# EAGLE design lamloei_app_a092500 (EAGLE 7.7.0)
CNAME: LamLoei A092500; CREVISION: R1; DESIGNER: lamloei co.,ltd.
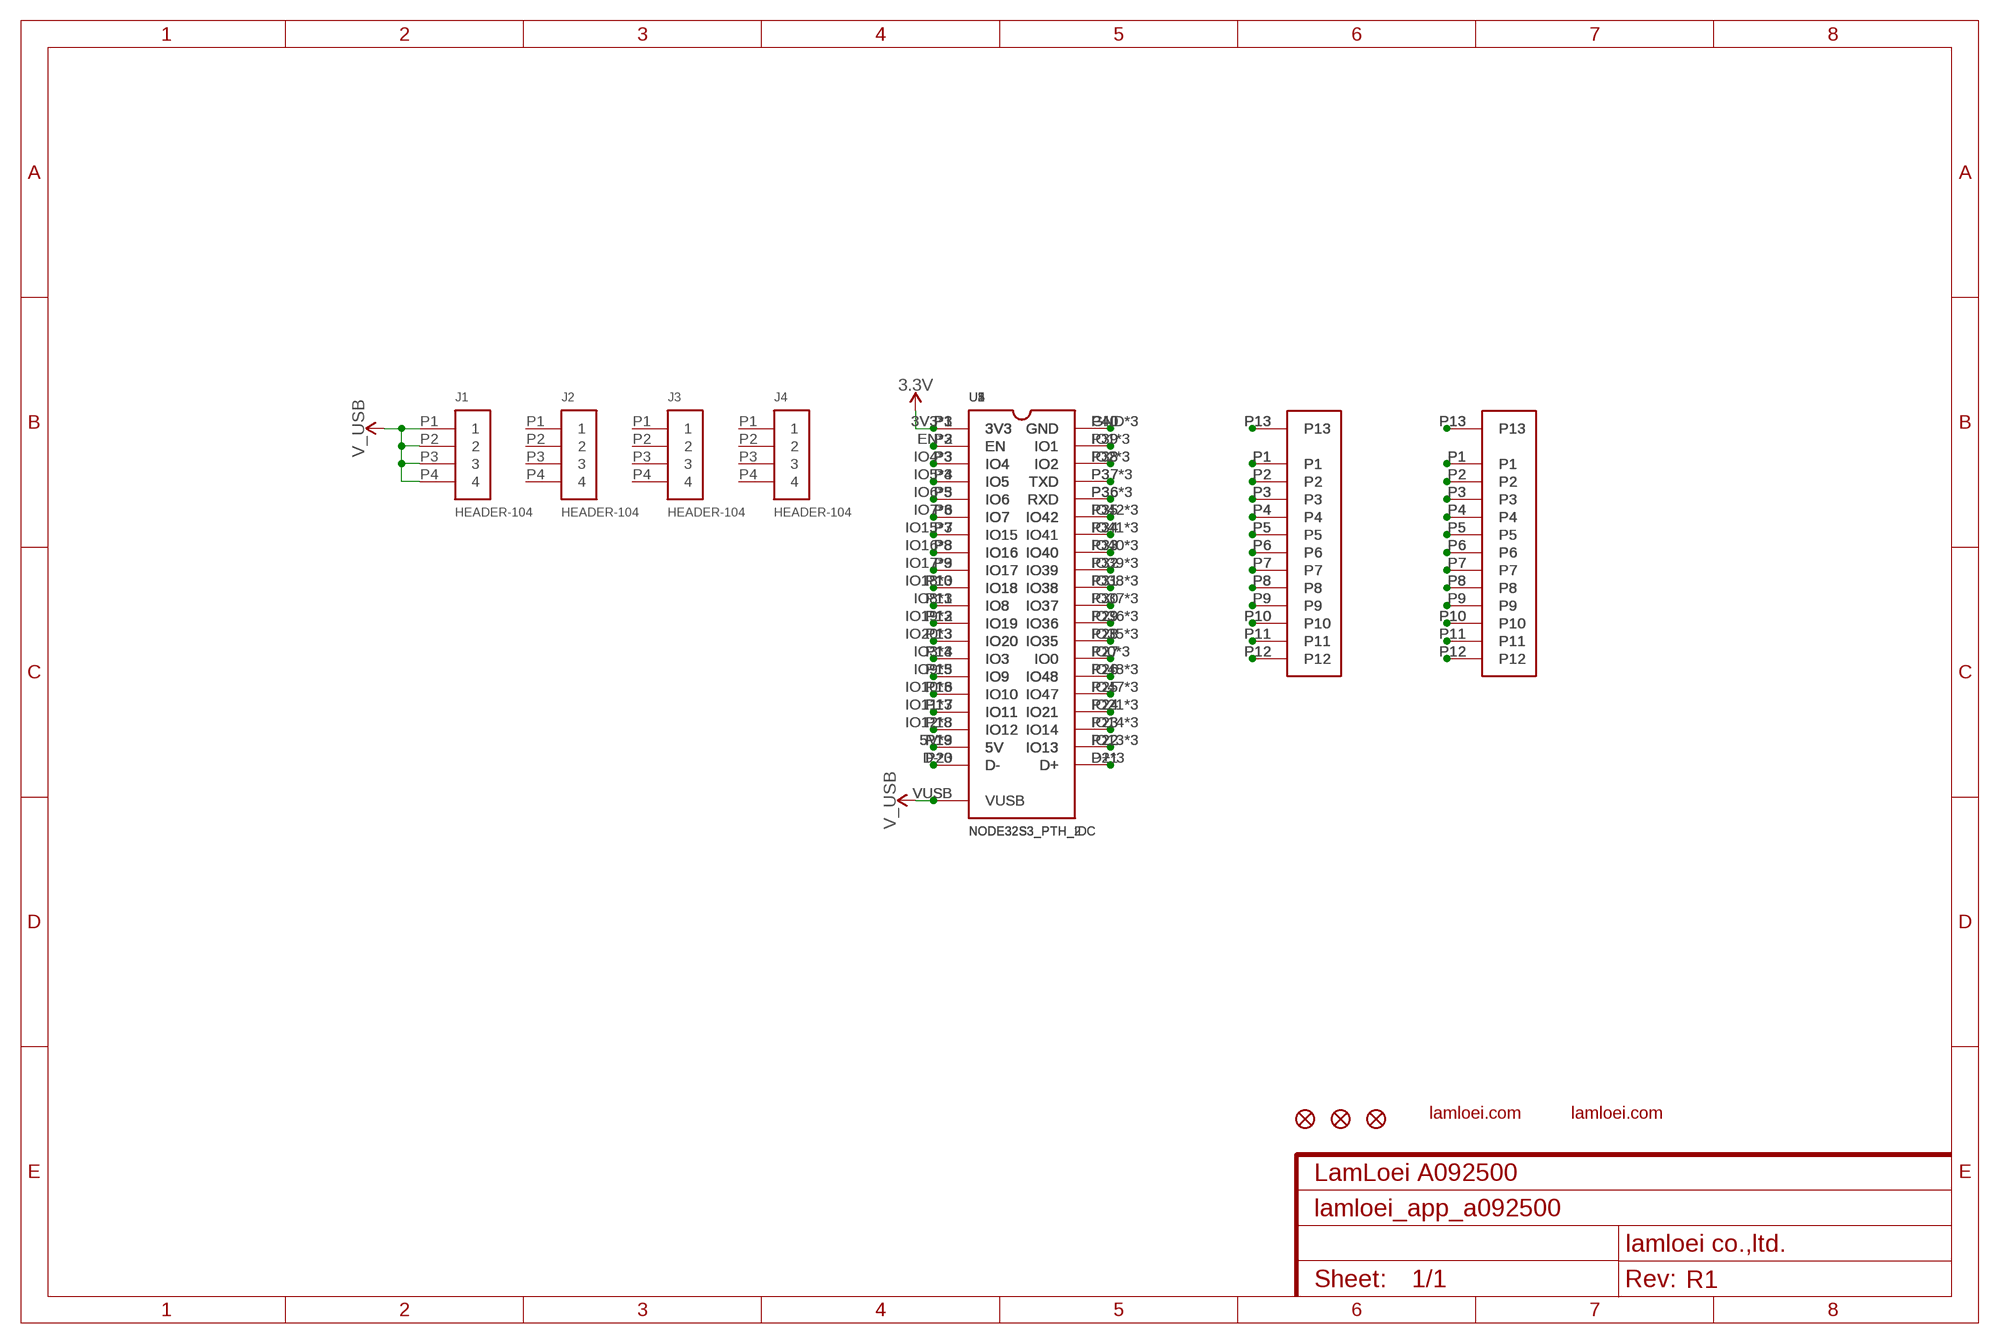
[diagram p0: schematic, sheet 1]

## Parts
J1  HEADER-104  [HEADER-104]
J2  HEADER-104  [HEADER-104]
J3  HEADER-104  [HEADER-104]
J4  HEADER-104  [HEADER-104]
U1  NODE32S3_PTH_2  [NODE32S3_PTH_2]
U2  NODE32S3_PTH_2  [NODE32S3_PTH_2]
U3  NODE32S3_PTH_IDC  [NODE32S3_PTH_IDC]
U4  NODE32S3_PTH_IDC  [NODE32S3_PTH_IDC]
U5  NODE32S3_PTH_IDC  [NODE32S3_PTH_IDC]
X1  5EHDRC-12P  [5EHDRC-12P]
X2  5EHDRC-12P-5.08MM  [5EHDRC-12P-5.08MM]
X3  5EHDRC-12P-2  [5EHDRC-12P-2]
X4  5EHDRC-12P  [5EHDRC-12P]
X5  5EHDRC-12P-5.08MM  [5EHDRC-12P-5.08MM]
X6  5EHDRC-12P-2  [5EHDRC-12P-2]
ZFD1  FIDUCIAL1X2  [FIDUCIAL-1X2]
ZFD2  FIDUCIAL1X2  [FIDUCIAL-1X2]
ZFD3  FIDUCIAL1X2  [FIDUCIAL-1X2]
ZL1  LAMLEOI_LOGO_3  [LAMLEOI_LOGO_3]
ZL2  LAMLEOI_LOGO_3  [LAMLEOI_LOGO_3]

## Nets
3.3V: U1.3V3 U1.P1(3V3) U1.Q1(3V3) U2.3V3 U2.P1(3V3) U2.Q1(3V3) U3.P1(3V3) U4.P1(3V3) U5.P1(3V3)
N$3: U1.EN U1.P2(EN) U1.Q2(EN) U2.EN U2.P2(EN) U2.Q2(EN) U3.P2(EN) U4.P2(EN) U5.P2(EN)
N$4: U1.IO4 U1.P3(IO4) U1.Q3(IO4) U2.IO4 U2.P3(IO4) U2.Q3(IO4) U3.P3(IO4) U4.P3(IO4) U5.P3(IO4)
N$5: U1.IO5 U1.P4(IO5) U1.Q4(IO5) U2.IO5 U2.P4(IO5) U2.Q4(IO5) U3.P4(IO5) U4.P4(IO5) U5.P4(IO5)
N$6: U1.IO6 U1.P5(IO6) U1.Q5(IO6) U2.IO6 U2.P5(IO6) U2.Q5(IO6) U3.P5(IO6) U4.P5(IO6) U5.P5(IO6)
N$7: U1.IO7 U1.P6(IO7) U1.Q6(IO7) U2.IO7 U2.P6(IO7) U2.Q6(IO7) U3.P6(IO7) U4.P6(IO7) U5.P6(IO7)
N$8: U1.IO15 U1.P7(IO15) U1.Q7(IO15) U2.IO15 U2.P7(IO15) U2.Q7(IO15) U3.P7(IO15) U4.P7(IO15) U5.P7(IO15)
N$9: U1.IO16 U1.P8(IO16) U1.Q8(IO16) U2.IO16 U2.P8(IO16) U2.Q8(IO16) U3.P8(IO16) U4.P8(IO16) U5.P8(IO16)
N$10: U1.IO17 U1.P9(IO17) U1.Q9(IO17) U2.IO17 U2.P9(IO17) U2.Q9(IO17) U3.P9(IO17) U4.P9(IO17) U5.P9(IO17)
N$11: U1.IO18 U1.P10(IO18) U1.Q10(IO18) U2.IO18 U2.P10(IO18) U2.Q10(IO18) U3.P10(IO18) U4.P10(IO18) U5.P10(IO18)
N$12: U1.IO8 U1.P11(IO8) U1.Q11(IO8) U2.IO8 U2.P11(IO8) U2.Q11(IO8) U3.P11(IO8) U4.P11(IO8) U5.P11(IO8)
N$13: U1.IO19 U1.P12(IO19) U1.Q12(IO19) U2.IO19 U2.P12(IO19) U2.Q12(IO19) U3.P12(IO19) U4.P12(IO19) U5.P12(IO19)
N$14: U1.IO20 U1.P13(IO20) U1.Q13(IO20) U2.IO20 U2.P13(IO20) U2.Q13(IO20) U3.P13(IO20) U4.P13(IO20) U5.P13(IO20)
N$15: U1.IO3 U1.P14(IO3) U1.Q14(IO3) U2.IO3 U2.P14(IO3) U2.Q14(IO3) U3.P14(IO3) U4.P14(IO3) U5.P14(IO3)
N$16: U1.IO9 U1.P15(IO9) U1.Q15(IO9) U2.IO9 U2.P15(IO9) U2.Q15(IO9) U3.P15(IO9) U4.P15(IO9) U5.P15(IO9)
N$17: U1.IO11 U1.P17(IO11) U1.Q17(IO11) U2.IO11 U2.P17(IO11) U2.Q17(IO11) U3.P17(IO11) U4.P17(IO11) U5.P17(IO11)
N$18: U1.IO10 U1.P16(IO10) U1.Q16(IO10) U2.IO10 U2.P16(IO10) U2.Q16(IO10) U3.P16(IO10) U4.P16(IO10) U5.P16(IO10)
N$19: U1.IO12 U1.P18(IO12) U1.Q18(IO12) U2.IO12 U2.P18(IO12) U2.Q18(IO12) U3.P18(IO12) U4.P18(IO12) U5.P18(IO12)
N$20: U1.5V U1.P19(5V) U1.Q19(5V) U2.5V U2.P19(5V) U2.Q19(5V) U3.P19(5V) U4.P19(5V) U5.P19(5V)
N$21: U1.D- U1.P20(D-) U1.Q20(D-) U2.D- U2.P20(D-) U2.Q20(D-) U3.P20(D-) U4.P20(D-) U5.P20(D-)
N$22: U1.D+ U1.P21(D+) U1.Q21(D+) U2.D+ U2.P21(D+) U2.Q21(D+) U3.P21(D+) U4.P21(D+) U5.P21(D+)
N$23: U1.IO13 U1.P22(IO13) U1.Q22(IO13) U2.IO13 U2.P22(IO13) U2.Q22(IO13) U3.P22(IO13) U4.P22(IO13) U5.P22(IO13)
N$24: U1.IO14 U1.P23(IO14) U1.Q23(IO14) U2.IO14 U2.P23(IO14) U2.Q23(IO14) U3.P23(IO14) U4.P23(IO14) U5.P23(IO14)
N$25: U1.IO21 U1.P24(IO21) U1.Q24(IO21) U2.IO21 U2.P24(IO21) U2.Q24(IO21) U3.P24(IO21) U4.P24(IO21) U5.P24(IO21)
N$26: U1.IO47 U1.P25(IO47) U1.Q25(IO47) U2.IO47 U2.P25(IO47) U2.Q25(IO47) U3.P25(IO47) U4.P25(IO47) U5.P25(IO47)
N$27: U1.IO48 U1.P26(IO48) U1.Q26(IO48) U2.IO48 U2.P26(IO48) U2.Q26(IO48) U3.P26(IO48) U4.P26(IO48) U5.P26(IO48)
N$28: U1.IO0 U1.P27(IO0) U1.Q27(IO0) U2.IO0 U2.P27(IO0) U2.Q27(IO0) U3.P27(IO0) U4.P27(IO0) U5.P27(IO0)
N$29: U1.IO35 U1.P28(IO35) U1.Q28(IO35) U2.IO35 U2.P28(IO35) U2.Q28(IO35) U3.P28(IO35) U4.P28(IO35) U5.P28(IO35)
N$30: U1.IO36 U1.P29(IO36) U1.Q29(IO36) U2.IO36 U2.P29(IO36) U2.Q29(IO36) U3.P29(IO36) U4.P29(IO36) U5.P29(IO36)
N$31: U1.IO37 U1.P30(IO37) U1.Q30(IO37) U2.IO37 U2.P30(IO37) U2.Q30(IO37) U3.P30(IO37) U4.P30(IO37) U5.P30(IO37)
N$32: U1.IO38 U1.P31(IO38) U1.Q31(IO38) U2.IO38 U2.P31(IO38) U2.Q31(IO38) U3.P31(IO38) U4.P31(IO38) U5.P31(IO38)
N$33: U1.IO39 U1.P32(IO39) U1.Q32(IO39) U2.IO39 U2.P32(IO39) U2.Q32(IO39) U3.P32(IO39) U4.P32(IO39) U5.P32(IO39)
N$34: U1.IO40 U1.P33(IO40) U1.Q33(IO40) U2.IO40 U2.P33(IO40) U2.Q33(IO40) U3.P33(IO40) U4.P33(IO40) U5.P33(IO40)
N$35: U1.IO41 U1.P34(IO41) U1.Q34(IO41) U2.IO41 U2.P34(IO41) U2.Q34(IO41) U3.P34(IO41) U4.P34(IO41) U5.P34(IO41)
N$36: U1.IO42 U1.P35(IO42) U1.Q35(IO42) U2.IO42 U2.P35(IO42) U2.Q35(IO42) U3.P35(IO42) U4.P35(IO42) U5.P35(IO42)
N$37: U1.P36(RXD) U1.Q36(RXD) U1.RXD U2.P36(RXD) U2.Q36(RXD) U2.RXD U3.P36(RXD) U4.P36(RXD) U5.P36(RXD)
N$38: U1.P37(TXD) U1.Q37(TXD) U1.TXD U2.P37(TXD) U2.Q37(TXD) U2.TXD U3.P37(TXD) U4.P37(TXD) U5.P37(TXD)
N$39: U1.IO2 U1.P38(IO2) U1.Q38(IO2) U2.IO2 U2.P38(IO2) U2.Q38(IO2) U3.P38(IO2) U4.P38(IO2) U5.P38(IO2)
N$40: U1.IO1 U1.P39(IO1) U1.Q39(IO1) U2.IO1 U2.P39(IO1) U2.Q39(IO1) U3.P39(IO1) U4.P39(IO1) U5.P39(IO1)
N$41: U1.GND U1.P40(GND) U1.Q40(GND) U2.GND U2.P40(GND) U2.Q40(GND) U3.P40(GND) U4.P40(GND) U5.P40(GND)
N$42: X1.P1 X2.P1 X3.P1
N$43: X1.P2 X2.P2 X3.P2
N$44: X1.P3 X2.P3 X3.P3
N$45: X1.P4 X2.P4 X3.P4
N$46: X1.P5 X2.P5 X3.P5
N$47: X1.P6 X2.P6 X3.P6
N$48: X1.P7 X2.P7 X3.P7
N$49: X1.P8 X2.P8 X3.P8
N$50: X1.P9 X2.P9 X3.P9
N$51: X1.P10 X2.P10 X3.P10
N$52: X1.P11 X2.P11 X3.P11
N$53: X1.P12 X2.P12 X3.P12
N$54: X1.P13 X2.P13 X3.P13
N$55: X4.P1 X5.P1 X6.P1
N$56: X4.P2 X5.P2 X6.P2
N$57: X4.P3 X5.P3 X6.P3
N$58: X4.P4 X5.P4 X6.P4
N$59: X4.P5 X5.P5 X6.P5
N$60: X4.P6 X5.P6 X6.P6
N$61: X4.P7 X5.P7 X6.P7
N$62: X4.P8 X5.P8 X6.P8
N$63: X4.P9 X5.P9 X6.P9
N$64: X4.P10 X5.P10 X6.P10
N$65: X4.P11 X5.P11 X6.P11
N$66: X4.P12 X5.P12 X6.P12
N$67: X4.P13 X5.P13 X6.P13
V_USB: J1.P1 J1.P2 J1.P3 J1.P4 U1.VUSB U2.VUSB
Unconnected: J2.P1 J2.P2 J2.P3 J2.P4 J3.P1 J3.P2 J3.P3 J3.P4 J4.P1 J4.P2 J4.P3 J4.P4

## Library data of the parts
J1-J4 = lamloei_e77_HEADER-104A:HEADER-104
U1 U2 = lamloei_e77_node32s3:NODE32S3_PTH_2
U3-U5 = lamloei_e77_node32s3:NODE32S3_PTH_IDC
X1 X4 = lamloei_e77_5EHDRC-12P:5EHDRC-12P
X2 X5 = lamloei_e77_5EHDRC-12P:5EHDRC-12P-5.08MM
X3 X6 = lamloei_e77_5EHDRC-12P:5EHDRC-12P-2
ZFD1-ZFD3 = SparkFun-Aesthetics:FIDUCIAL: Fiducial Alignment Points Point-of-reference for pick-and-place machines and other optical instruments.
ZL1 ZL2 = lamloei_logo_3:LAMLEOI_LOGO_3: lamloei

## Board
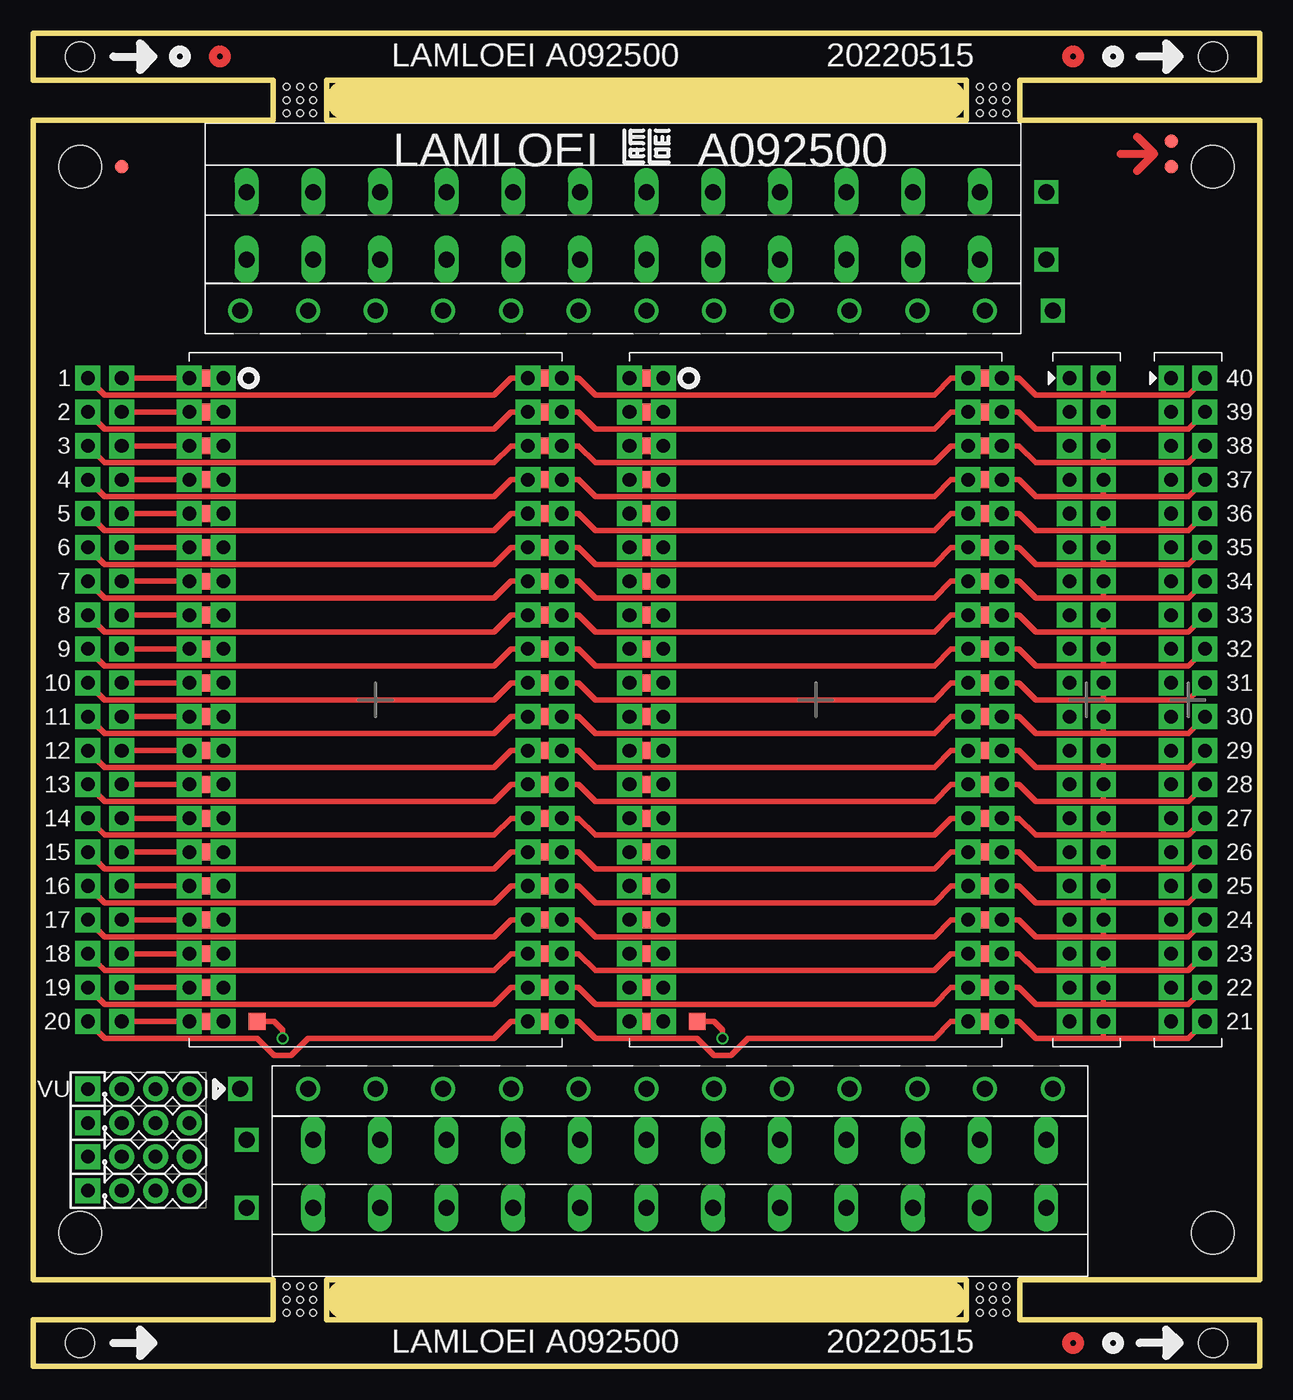
[diagram p1: board, top side]
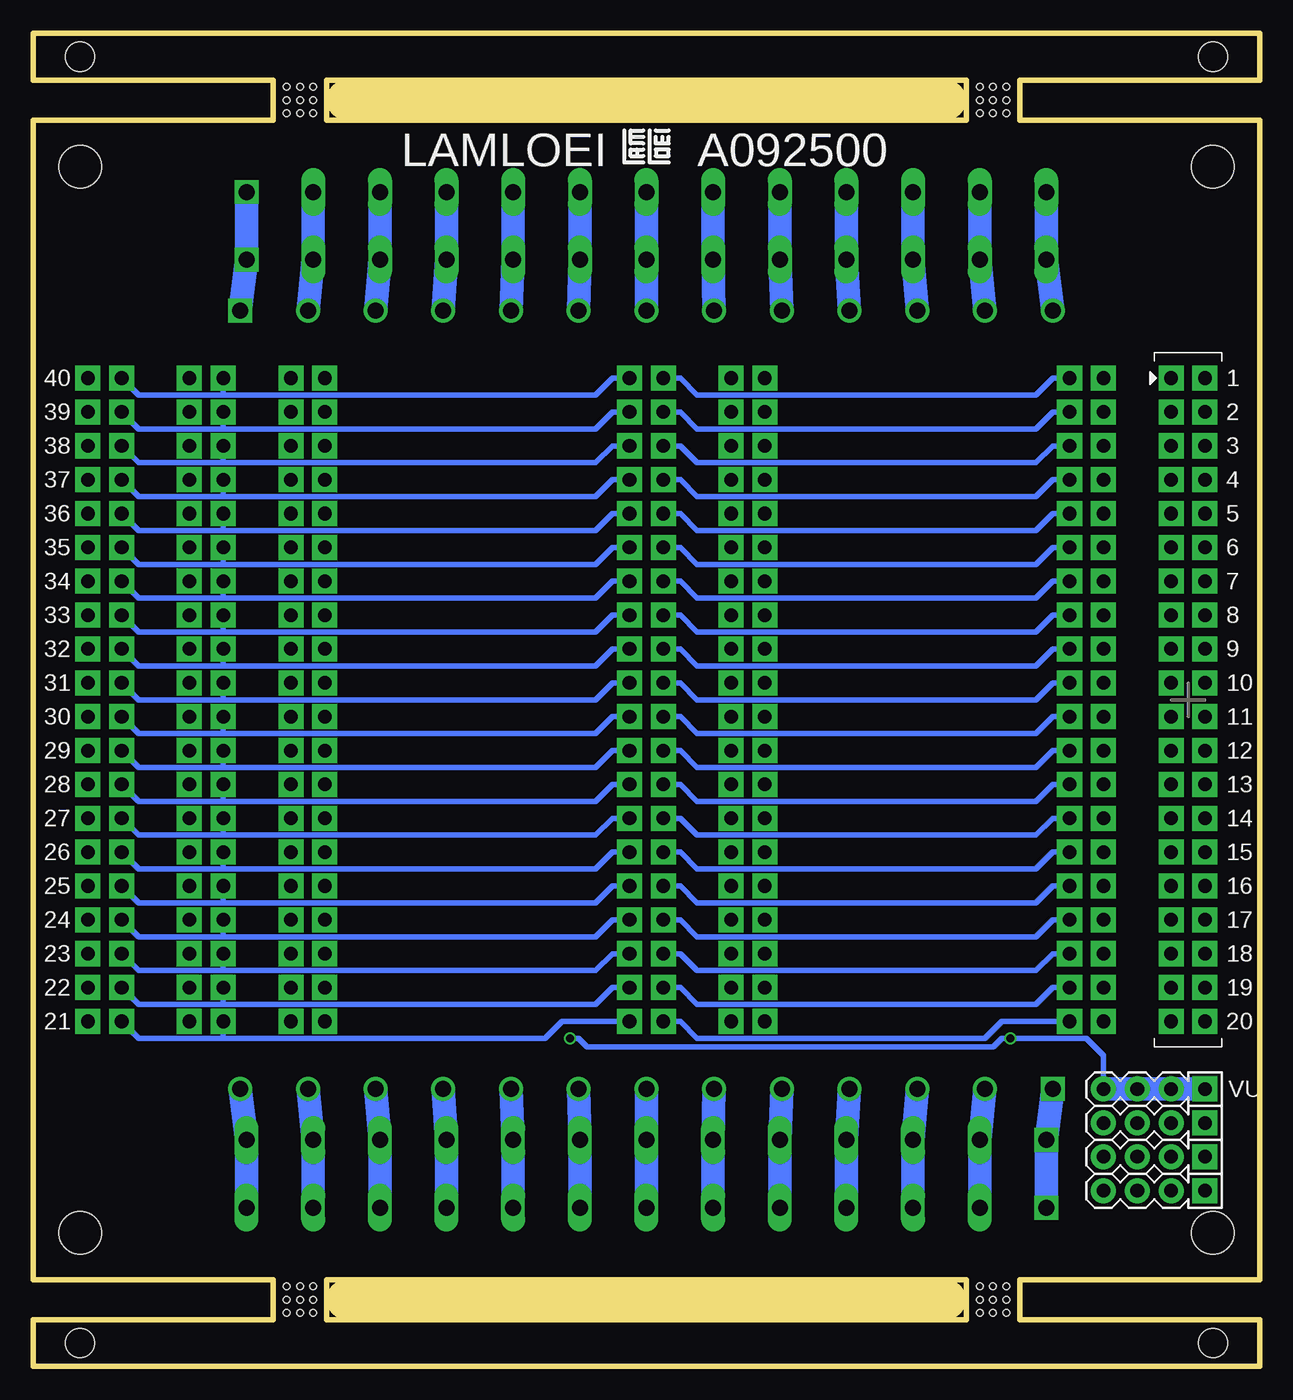
[diagram p2: board, bottom side, seen from below]

Size 92 x 100 mm. Coordinates in mm from the lower left corner, seen from the top.
Outline: 0,93.5 18,93.5 18,96.5 0,96.5 0,100 92,100 92,96.5 74,96.5 74,93.5 92,93.5 92,6.5 74,6.5 74,3.5 92,3.5 92,0 0,0 0,3.5 18,3.5 18,6.5 0,6.5 0,93.5
Outline: 22,93.5 70,93.5 70,96.5 22,96.5 22,93.5
Outline: 70,6.5 22,6.5 22,3.5 70,3.5 70,6.5
Copper layers (1*16): Top 0.035mm / dielectric 0.2mm / Bottom 0.035mm
Design rules "jlcpcb-2-layer": minimum track width 3.5mil, minimum drill 0.2mm, track to track 3.5mil, track to pad 5mil, pad to pad 5mil, via to via 5mil, smd to smd 0mil, copper to edge 0.1mm, drill to drill 5mil, minimum pad ring 4mil, minimum via ring 4mil, stop-mask expansion 3mil, vias tented up to drill 100mil, thermal gap 10mil
Holes 3.2 mm at 3.5,10 88.5,10 3.5,90 88.5,90
Holes 0.5 mm at 20,94 21,94 19,94 19,95 19,96 20,96 20,95 21,95 21,96 72,94 71,94 71,95 71,96 72,96 72,95 73,95 73,94 73,96 20,6 19,6 19,5 19,4 20,4 20,5 21,6 21,5 21,4 72,6 71,6 71,5 71,4 72,5 72,4 73,4 73,5 73,6
Holes 2.2 mm at 3.5,1.75 88.5,1.75 3.5,98.25 88.5,98.25
Milling: 2 lines

### Footprints (pad centres in the part's own frame; a part is rotated, then mirrored left to right if it is on the bottom)
HEADER-104 = drill 1.016 pad 1.88 square: P1 3.81,0 | drill 1.016 pad 1.88: P2 1.27,0; P3 -1.27,0; P4 -3.81,0
NODE32S3_PTH_2 = smd 3.81 x 1.27: 3V3 0.635,50.165; 5V 0.635,4.445; D+ 26.035,1.905; D- 0.635,1.905; EN 0.635,47.625; GND 26.035,50.165; IO0 26.035,17.145; IO1 26.035,47.625; IO2 26.035,45.085; IO3 0.635,17.145; IO4 0.635,45.085; IO5 0.635,42.545; IO6 0.635,40.005; IO7 0.635,37.465; IO8 0.635,24.765; IO9 0.635,14.605; IO10 0.635,12.065; IO11 0.635,9.525; IO12 0.635,6.985; IO13 26.035,4.445; IO14 26.035,6.985; IO15 0.635,34.925; IO16 0.635,32.385; IO17 0.635,29.845; IO18 0.635,27.305; IO19 0.635,22.225; IO20 0.635,19.685; IO21 26.035,9.525; IO35 26.035,19.685; IO36 26.035,22.225; IO37 26.035,24.765; IO38 26.035,27.305; IO39 26.035,29.845; IO40 26.035,32.385; IO41 26.035,34.925; IO42 26.035,37.465; IO47 26.035,12.065; IO48 26.035,14.605; RXD 26.035,40.005; TXD 26.035,42.545 | drill 1.016 pad 1.88 square: P1 1.905,50.165; P2 1.905,47.625; P3 1.905,45.085; P4 1.905,42.545; P5 1.905,40.005; P6 1.905,37.465; P7 1.905,34.925; P8 1.905,32.385; P9 1.905,29.845; P10 1.905,27.305; P11 1.905,24.765; P12 1.905,22.225; P13 1.905,19.685; P14 1.905,17.145; P15 1.905,14.605; P16 1.905,12.065; P17 1.905,9.525; P18 1.905,6.985; P19 1.905,4.445; P20 1.905,1.905; P21 24.765,1.905; P22 24.765,4.445; P23 24.765,6.985; P24 24.765,9.525; P25 24.765,12.065; P26 24.765,14.605; P27 24.765,17.145; P28 24.765,19.685; P29 24.765,22.225; P30 24.765,24.765; P31 24.765,27.305; P32 24.765,29.845; P33 24.765,32.385; P34 24.765,34.925; P35 24.765,37.465; P36 24.765,40.005; P37 24.765,42.545; P38 24.765,45.085; P39 24.765,47.625; P40 24.765,50.165; Q1 -0.635,50.165; Q2 -0.635,47.625; Q3 -0.635,45.085; Q4 -0.635,42.545; Q5 -0.635,40.005; Q6 -0.635,37.465; Q7 -0.635,34.925; Q8 -0.635,32.385; Q9 -0.635,29.845; Q10 -0.635,27.305; Q11 -0.635,24.765; Q12 -0.635,22.225; Q13 -0.635,19.685; Q14 -0.635,17.145; Q15 -0.635,14.605; Q16 -0.635,12.065; Q17 -0.635,9.525; Q18 -0.635,6.985; Q19 -0.635,4.445; Q20 -0.635,1.905; Q21 27.305,1.905; Q22 27.305,4.445; Q23 27.305,6.985; Q24 27.305,9.525; Q25 27.305,12.065; Q26 27.305,14.605; Q27 27.305,17.145; Q28 27.305,19.685; Q29 27.305,22.225; Q30 27.305,24.765; Q31 27.305,27.305; Q32 27.305,29.845; Q33 27.305,32.385; Q34 27.305,34.925; Q35 27.305,37.465; Q36 27.305,40.005; Q37 27.305,42.545; Q38 27.305,45.085; Q39 27.305,47.625; Q40 27.305,50.165 | smd 1.27 x 1.27: VUSB 4.445,1.905
NODE32S3_PTH_IDC = drill 1.016 pad 1.88 square: P1 -1.27,24.13; P2 -1.27,21.59; P3 -1.27,19.05; P4 -1.27,16.51; P5 -1.27,13.97; P6 -1.27,11.43; P7 -1.27,8.89; P8 -1.27,6.35; P9 -1.27,3.81; P10 -1.27,1.27; P11 -1.27,-1.27; P12 -1.27,-3.81; P13 -1.27,-6.35; P14 -1.27,-8.89; P15 -1.27,-11.43; P16 -1.27,-13.97; P17 -1.27,-16.51; P18 -1.27,-19.05; P19 -1.27,-21.59; P20 -1.27,-24.13; P21 1.27,-24.13; P22 1.27,-21.59; P23 1.27,-19.05; P24 1.27,-16.51; P25 1.27,-13.97; P26 1.27,-11.43; P27 1.27,-8.89; P28 1.27,-6.35; P29 1.27,-3.81; P30 1.27,-1.27; P31 1.27,1.27; P32 1.27,3.81; P33 1.27,6.35; P34 1.27,8.89; P35 1.27,11.43; P36 1.27,13.97; P37 1.27,16.51; P38 1.27,19.05; P39 1.27,21.59; P40 1.27,24.13
5EHDRC-12P = drill 1.2 long: P1 -25,0; P2 -20,0; P3 -15,0; P4 -10,0; P5 -5,0; P6 0,0; P7 5,0; P8 10,0; P9 15,0; P10 20,0; P11 25,0; P12 30,0 | drill 1.2 square: P13 -30,0
5EHDRC-12P-5.08MM = drill 1.2: P1 -25.4,0; P2 -20.32,0; P3 -15.24,0; P4 -10.16,0; P5 -5.08,0; P6 0,0; P7 5.08,0; P8 10.16,0; P9 15.24,0; P10 20.32,0; P11 25.4,0; P12 30.48,0 | drill 1.2 square: P13 -30.48,0
5EHDRC-12P-2 = drill 1.2 long: P1 -25,0; P2 -20,0; P3 -15,0; P4 -10,0; P5 -5,0; P6 0,0; P7 5,0; P8 10,0; P9 15,0; P10 20,0; P11 25,0; P12 30,0 | drill 1.2 square: P13 -30,0
FIDUCIAL-1X2 = smd 1 x 1: 1 0,0

### Placement (x,y rotation side)
J1  7.9,20.79 180 top
J2  7.9,18.25 180 top
J3  7.9,15.71 180 top
J4  7.9,13.17 180 top
U1  45.37,23.96 0 top
U2  12.34,23.96 0 top
U3  79.02,50 0 top
U4  86.64,50 0 top
U5  5.36,50 0 bottom
X1  46,16.98 0 top
X2  46,20.79 0 top
X3  46,11.9 0 top
X4  46,83.02 180 top
X5  46,79.21 180 top
X6  46,88.1 180 top
ZFD1  6.63,90 0 top
ZFD2  85.37,91.91 0 top
ZFD3  85.37,90 0 top
ZL1  44.02,90 0 top
ZL2  47.98,90 0 bottom

### Tracks (layer width: path | path; a pad name or v marks a point on that pad's centre or on a via)
3.3V
  Top 0.406: U1.3V3 U1.Q1 U1.3V3 | U1.3V3 U1.P1 | U5.P1 U2.Q1 U2.3V3 U2.P1
  Bottom 0.406: U1.P1 48.54,74.13 49.81,72.86 77.75,72.86 | 77.75,72.86 84.1,72.86 U4.P1 | U3.P1 77.75,72.86 | U2.P1 15.52,74.13 16.79,72.86 42.19,72.86 43.46,74.13 U1.Q1
N$1
  Top 0.61: 81.56,90.96 84.1,90.96 | 84.1,90.96 82.83,92.23 | 82.83,89.69 84.1,90.96
N$3
  Top 0.406: U1.EN U1.Q2 U1.EN | U1.EN U1.P2 | U5.P2 U2.Q2 | U2.Q2 U2.EN | U2.EN U2.P2 | U2.Q2 U2.EN
  Bottom 0.406: U1.P2 48.54,71.59 49.81,70.32 77.75,70.32 | 77.75,70.32 84.1,70.32 U4.P2 | U3.P2 77.75,70.32 | U2.P2 15.52,71.59 16.79,70.32 42.19,70.32 43.46,71.59 U1.Q2
N$4
  Top 0.406: U1.Q3 U1.IO4 U1.P3 | U5.P3 U2.Q3 | U2.Q3 U2.IO4 | U2.IO4 U2.P3 | U2.IO4 U2.Q3
  Bottom 0.406: U1.P3 48.54,69.05 49.81,67.78 77.75,67.78 | 77.75,67.78 84.1,67.78 U4.P3 | U3.P3 77.75,67.78 | U2.P3 15.52,69.05 16.79,67.78 42.19,67.78 43.46,69.05 U1.Q3
N$5
  Top 0.406: U5.P4 U2.Q4
  Bottom 0.406: U1.P4 48.54,66.51 49.81,65.24 77.75,65.24 | 77.75,65.24 84.1,65.24 U4.P4 | U3.P4 77.75,65.24 | U2.P4 15.52,66.51 16.79,65.24 42.19,65.24 43.46,66.51 U1.Q4
N$6
  Top 0.406: U5.P5 U2.Q5
  Bottom 0.406: U1.P5 48.54,63.97 49.81,62.7 77.75,62.7 | 77.75,62.7 84.1,62.7 U4.P5 | U3.P5 77.75,62.7 | U2.P5 15.52,63.97 16.79,62.7 42.19,62.7 43.46,63.97 U1.Q5
N$7
  Top 0.406: U5.P6 U2.Q6
  Bottom 0.406: U1.P6 48.54,61.43 49.81,60.16 77.75,60.16 | 77.75,60.16 84.1,60.16 U4.P6 | U3.P6 77.75,60.16 | U2.P6 15.52,61.43 16.79,60.16 42.19,60.16 43.46,61.43 U1.Q6
N$8
  Top 0.406: U5.P7 U2.Q7
  Bottom 0.406: U1.P7 48.54,58.89 49.81,57.62 77.75,57.62 | 77.75,57.62 84.1,57.62 U4.P7 | U3.P7 77.75,57.62 | U2.P7 15.52,58.89 16.79,57.62 42.19,57.62 43.46,58.89 U1.Q7
N$9
  Top 0.406: U1.Q8 U1.IO16 U1.P8 | U5.P8 U2.Q8 U2.IO16 U2.P8
  Bottom 0.406: U1.P8 48.54,56.35 49.81,55.08 77.75,55.08 | 77.75,55.08 84.1,55.08 U4.P8 | U3.P8 77.75,55.08 | U2.P8 15.52,56.35 16.79,55.08 42.19,55.08 43.46,56.35 U1.Q8
N$10
  Top 0.406: U1.Q9 U1.IO17 U1.P9 | U5.P9 U2.Q9 U2.IO17 U2.P9
  Bottom 0.406: U1.P9 48.54,53.81 49.81,52.54 77.75,52.54 | 77.75,52.54 84.1,52.54 U4.P9 | U3.P9 77.75,52.54 | U2.P9 15.52,53.81 16.79,52.54 42.19,52.54 43.46,53.81 U1.Q9
N$11
  Top 0.406: U1.Q10 U1.IO18 U1.P10 | U5.P10 U2.Q10 U2.IO18 U2.P10
  Bottom 0.406: U1.P10 48.54,51.27 49.81,50 77.75,50 | 77.75,50 84.1,50 U4.P10 | U3.P10 77.75,50 | U2.P10 15.52,51.27 16.79,50 42.19,50 43.46,51.27 U1.Q10
N$12
  Top 0.406: U5.P11 U2.Q11
  Bottom 0.406: U1.P11 48.54,48.73 49.81,47.46 77.75,47.46 | 77.75,47.46 84.1,47.46 U4.P11 | U3.P11 77.75,47.46 | U2.P11 15.52,48.73 16.79,47.46 42.19,47.46 43.46,48.73 U1.Q11
N$13
  Top 0.406: U1.P12 U1.IO19 U1.Q12 | U5.P12 U2.Q12 U2.IO19 U2.P12
  Bottom 0.406: U1.P12 48.54,46.19 49.81,44.92 77.75,44.92 | 77.75,44.92 84.1,44.92 U4.P12 | U3.P12 77.75,44.92 | U2.P12 15.52,46.19 16.79,44.92 42.19,44.92 43.46,46.19 U1.Q12
N$14
  Top 0.406: U1.P13 U1.IO20 U1.Q13 | U5.P13 U2.Q13 U2.IO20 U2.P13
  Bottom 0.406: U1.P13 48.54,43.65 49.81,42.38 77.75,42.38 | 77.75,42.38 84.1,42.38 U4.P13 | U3.P13 77.75,42.38 | U2.P13 15.52,43.65 16.79,42.38 42.19,42.38 43.46,43.65 U1.Q13
N$15
  Top 0.406: U1.Q14 U1.IO3 U1.P14 | U5.P14 U2.Q14 U2.IO3 U2.P14
  Bottom 0.406: U1.P14 48.54,41.11 49.81,39.84 77.75,39.84 | 77.75,39.84 84.1,39.84 U4.P14 | U3.P14 77.75,39.84 | U2.P14 15.52,41.11 16.79,39.84 42.19,39.84 43.46,41.11 U1.Q14
N$16
  Top 0.406: U1.Q15 U1.IO9 U1.P15 | U5.P15 U2.Q15 U2.IO9 U2.P15
  Bottom 0.406: U1.P15 48.54,38.57 49.81,37.3 77.75,37.3 | 77.75,37.3 84.1,37.3 U4.P15 | U3.P15 77.75,37.3 | U2.P15 15.52,38.57 16.79,37.3 42.19,37.3 43.46,38.57 U1.Q15
N$17
  Top 0.406: U1.Q17 U1.IO11 U1.P17 | U5.P17 U2.Q17 U2.IO11 U2.P17
  Bottom 0.406: U1.P17 48.54,33.49 49.81,32.22 77.75,32.22 | 77.75,32.22 84.1,32.22 U4.P17 | U3.P17 77.75,32.22 | U2.P17 15.52,33.49 16.79,32.22 42.19,32.22 43.46,33.49 U1.Q17
N$18
  Top 0.406: U5.P16 U2.Q16
  Bottom 0.406: U1.P16 48.54,36.03 49.81,34.76 77.75,34.76 | 77.75,34.76 84.1,34.76 U4.P16 | U3.P16 77.75,34.76 | U2.P16 15.52,36.03 16.79,34.76 42.19,34.76 43.46,36.03 U1.Q16
N$19
  Top 0.406: U1.Q18 U1.IO12 U1.P18 | U5.P18 U2.Q18 U2.IO12 U2.P18
  Bottom 0.406: U1.P18 48.54,30.95 49.81,29.68 77.75,29.68 | 77.75,29.68 84.1,29.68 U4.P18 | U3.P18 77.75,29.68 | U2.P18 15.52,30.95 16.79,29.68 42.19,29.68 43.46,30.95 U1.Q18
N$20
  Top 0.406: U1.Q19 U1.5V U1.P19 | U5.P19 U2.Q19 U2.5V U2.P19
  Bottom 0.406: U1.P19 48.54,28.41 49.81,27.14 77.75,27.14 | 77.75,27.14 84.1,27.14 U4.P19 | U3.P19 77.75,27.14 | U1.Q19 43.46,28.41 42.19,27.14 16.79,27.14 15.52,28.41 U2.P19
N$21
  Top 0.406: U1.P20 U1.D- U1.Q20 | U5.P20 U2.Q20 U2.D- U2.P20
  Bottom 0.406: U1.P20 52.35,25.87 53.62,24.6 77.75,24.6 | 77.75,24.6 84.1,24.6 U4.P20 | U3.P20 77.75,24.6 | U2.P20 19.33,25.87 20.6,24.6 42.19,24.6 43.46,25.87 U1.Q20
N$22
  Top 0.406: U1.Q21 73.94,25.87 75.21,24.6 80.29,24.6 | 80.29,24.6 86.64,24.6 U4.P21 | U3.P21 80.29,24.6 | U2.P21 35.84,25.87 34.57,24.6 20.6,24.6 19.33,23.33 18.06,23.33 16.79,24.6 5.36,24.6 U5.P21 | U1.P21 68.86,25.87 67.59,24.6 53.62,24.6 52.35,23.33 51.08,23.33 49.81,24.6 42.19,24.6 40.92,25.87 U2.Q21
N$23
  Top 0.406: 80.29,27.14 75.21,27.14 73.94,28.41 U1.Q22 U1.IO13 U1.P22 68.86,28.41 67.59,27.14 42.19,27.14 40.92,28.41 U2.Q22 U2.IO13 U2.P22 35.84,28.41 34.57,27.14 5.36,27.14 U5.P22 | 80.29,27.14 86.64,27.14 U4.P22 | U3.P22 80.29,27.14
N$24
  Top 0.406: 80.29,29.68 75.21,29.68 73.94,30.95 U1.Q23 U1.IO14 U1.P23 68.86,30.95 67.59,29.68 42.19,29.68 40.92,30.95 U2.Q23 U2.IO14 U2.P23 35.84,30.95 34.57,29.68 5.36,29.68 U5.P23 | 80.29,29.68 86.64,29.68 U4.P23 | U3.P23 80.29,29.68
N$25
  Top 0.406: 80.29,32.22 75.21,32.22 73.94,33.49 U1.Q24 U1.IO21 U1.P24 68.86,33.49 67.59,32.22 42.19,32.22 40.92,33.49 U2.Q24 U2.IO21 U2.P24 35.84,33.49 34.57,32.22 5.36,32.22 U5.P24 | 80.29,32.22 86.64,32.22 U4.P24 | U3.P24 80.29,32.22
N$26
  Top 0.406: U1.Q25 73.94,36.03 75.21,34.76 80.29,34.76 | 80.29,34.76 86.64,34.76 U4.P25 | U3.P25 80.29,34.76 | U1.P25 68.86,36.03 67.59,34.76 42.19,34.76 40.92,36.03 U2.Q25 | U2.P25 35.84,36.03 34.57,34.76 5.36,34.76 U5.P25
N$27
  Top 0.406: 80.29,37.3 75.21,37.3 73.94,38.57 U1.Q26 U1.IO48 U1.P26 68.86,38.57 67.59,37.3 42.19,37.3 40.92,38.57 U2.Q26 U2.IO48 U2.P26 35.84,38.57 34.57,37.3 5.36,37.3 U5.P26 | 80.29,37.3 86.64,37.3 U4.P26 | U3.P26 80.29,37.3
N$28
  Top 0.406: 80.29,39.84 75.21,39.84 73.94,41.11 U1.Q27 U1.IO0 U1.P27 68.86,41.11 67.59,39.84 42.19,39.84 40.92,41.11 U2.Q27 U2.IO0 U2.P27 35.84,41.11 34.57,39.84 5.36,39.84 U5.P27 | 80.29,39.84 86.64,39.84 U4.P27 | U3.P27 80.29,39.84
N$29
  Top 0.406: 80.29,42.38 75.21,42.38 73.94,43.65 U1.Q28 U1.IO35 U1.P28 68.86,43.65 67.59,42.38 42.19,42.38 40.92,43.65 U2.Q28 U2.IO35 U2.P28 35.84,43.65 34.57,42.38 5.36,42.38 U5.P28 | 80.29,42.38 86.64,42.38 U4.P28 | U3.P28 80.29,42.38
N$30
  Top 0.406: 80.29,44.92 75.21,44.92 73.94,46.19 U1.Q29 U1.IO36 U1.P29 68.86,46.19 67.59,44.92 42.19,44.92 40.92,46.19 U2.Q29 U2.IO36 U2.P29 35.84,46.19 34.57,44.92 5.36,44.92 U5.P29 | 80.29,44.92 86.64,44.92 U4.P29 | U3.P29 80.29,44.92
N$31
  Top 0.406: 80.29,47.46 75.21,47.46 73.94,48.73 U1.Q30 U1.IO37 U1.P30 68.86,48.73 67.59,47.46 42.19,47.46 40.92,48.73 U2.Q30 U2.IO37 U2.P30 35.84,48.73 34.57,47.46 5.36,47.46 U5.P30 | 80.29,47.46 86.64,47.46 U4.P30 | U3.P30 80.29,47.46
N$32
  Top 0.406: 80.29,50 75.21,50 73.94,51.27 U1.Q31 U1.IO38 U1.P31 68.86,51.27 67.59,50 42.19,50 40.92,51.27 U2.Q31 U2.IO38 U2.P31 35.84,51.27 34.57,50 5.36,50 U5.P31 | 80.29,50 86.64,50 U4.P31 | U3.P31 80.29,50
N$33
  Top 0.406: 80.29,52.54 75.21,52.54 73.94,53.81 U1.Q32 U1.IO39 U1.P32 68.86,53.81 67.59,52.54 42.19,52.54 40.92,53.81 U2.Q32 U2.IO39 U2.P32 35.84,53.81 34.57,52.54 5.36,52.54 U5.P32 | 80.29,52.54 86.64,52.54 U4.P32 | U3.P32 80.29,52.54
N$34
  Top 0.406: 80.29,55.08 75.21,55.08 73.94,56.35 U1.Q33 U1.IO40 U1.P33 68.86,56.35 67.59,55.08 42.19,55.08 40.92,56.35 U2.Q33 U2.IO40 U2.P33 35.84,56.35 34.57,55.08 5.36,55.08 U5.P33 | 80.29,55.08 86.64,55.08 U4.P33 | U3.P33 80.29,55.08
N$35
  Top 0.406: 80.29,57.62 75.21,57.62 73.94,58.89 U1.Q34 U1.IO41 U1.P34 68.86,58.89 67.59,57.62 42.19,57.62 40.92,58.89 U2.Q34 U2.IO41 U2.P34 35.84,58.89 34.57,57.62 5.36,57.62 U5.P34 | 80.29,57.62 86.64,57.62 U4.P34 | U3.P34 80.29,57.62
N$36
  Top 0.406: 80.29,60.16 75.21,60.16 73.94,61.43 U1.Q35 U1.IO42 U1.P35 68.86,61.43 67.59,60.16 42.19,60.16 40.92,61.43 U2.Q35 U2.IO42 U2.P35 35.84,61.43 34.57,60.16 5.36,60.16 U5.P35 | 80.29,60.16 86.64,60.16 U4.P35 | U3.P35 80.29,60.16
N$37
  Top 0.406: 80.29,62.7 75.21,62.7 73.94,63.97 U1.Q36 U1.RXD U1.P36 68.86,63.97 67.59,62.7 42.19,62.7 40.92,63.97 U2.Q36 U2.RXD U2.P36 35.84,63.97 34.57,62.7 5.36,62.7 U5.P36 | 80.29,62.7 86.64,62.7 U4.P36 | U3.P36 80.29,62.7
N$38
  Top 0.406: 80.29,65.24 75.21,65.24 73.94,66.51 U1.Q37 U1.TXD U1.P37 68.86,66.51 67.59,65.24 42.19,65.24 40.92,66.51 U2.Q37 U2.TXD U2.P37 35.84,66.51 34.57,65.24 5.36,65.24 U5.P37 | 80.29,65.24 86.64,65.24 U4.P37 | U3.P37 80.29,65.24
N$39
  Top 0.406: 80.29,67.78 75.21,67.78 73.94,69.05 U1.Q38 U1.IO2 U1.P38 68.86,69.05 67.59,67.78 42.19,67.78 40.92,69.05 U2.Q38 U2.IO2 U2.P38 35.84,69.05 34.57,67.78 5.36,67.78 U5.P38 | 80.29,67.78 86.64,67.78 U4.P38 | U3.P38 80.29,67.78
N$40
  Top 0.406: U1.Q39 73.94,71.59 75.21,70.32 80.29,70.32 | 80.29,70.32 86.64,70.32 U4.P39 | U3.P39 80.29,70.32 | U1.IO1 U1.P39 68.86,71.59 67.59,70.32 42.19,70.32 40.92,71.59 U2.Q39 U2.IO1 U2.P39 35.84,71.59 34.57,70.32 5.36,70.32 U5.P39 | U1.IO1 U1.Q39 | U1.Q39 U1.IO1
N$41
  Top 0.406: U1.Q40 73.94,74.13 75.21,72.86 80.29,72.86 | 80.29,72.86 86.64,72.86 U4.P40 | U3.P40 80.29,72.86 | U1.P40 68.86,74.13 67.59,72.86 42.19,72.86 40.92,74.13 U2.Q40 | U2.P40 35.84,74.13 34.57,72.86 5.36,72.86 U5.P40
N$42
  Bottom 1.778: X3.P1 X1.P1 X2.P1
N$43
  Bottom 1.778: X3.P2 X1.P2 X2.P2
N$44
  Bottom 1.778: X3.P3 X1.P3 X2.P3
N$45
  Bottom 1.778: X3.P4 X1.P4 X2.P4
N$46
  Bottom 1.778: X3.P5 X1.P5 X2.P5
N$47
  Bottom 1.778: X3.P6 X1.P6 X2.P6
N$48
  Bottom 1.778: X3.P7 X1.P7 X2.P7
N$49
  Bottom 1.778: X3.P8 X1.P8 X2.P8
N$50
  Bottom 1.778: X3.P9 X1.P9 X2.P9
N$51
  Bottom 1.778: X3.P10 X1.P10 X2.P10
N$52
  Bottom 1.778: X3.P11 X1.P11 X2.P11
N$53
  Bottom 1.778: X3.P12 X1.P12 X2.P12
N$54
  Bottom 1.778: X3.P13 X1.P13 X2.P13
N$55
  Bottom 1.778: X5.P1 X4.P1 X6.P1
N$56
  Bottom 1.778: X5.P2 X4.P2 X6.P2
N$57
  Bottom 1.778: X5.P3 X4.P3 X6.P3
N$58
  Bottom 1.778: X5.P4 X4.P4 X6.P4
N$59
  Bottom 1.778: X5.P5 X4.P5 X6.P5
N$60
  Bottom 1.778: X5.P6 X4.P6 X6.P6
N$61
  Bottom 1.778: X5.P7 X4.P7 X6.P7
N$62
  Bottom 1.778: X5.P8 X4.P8 X6.P8
N$63
  Bottom 1.778: X5.P9 X4.P9 X6.P9
N$64
  Bottom 1.778: X5.P10 X4.P10 X6.P10
N$65
  Bottom 1.778: X5.P11 X4.P11 X6.P11
N$66
  Bottom 1.778: X5.P12 X4.P12 X6.P12
N$67
  Bottom 1.778: X5.P13 X4.P13 X6.P13
V_USB  (via drill 0.6)
  Top 0.406: U2.VUSB 18.06,25.87 18.7,25.23 v18.7,24.6 | U1.VUSB 51.08,25.87 51.72,25.23 v51.72,24.6
  Bottom 0.406: v51.72,24.6 51.08,24.6 50.45,23.96 19.96,23.96 19.33,24.6 v18.7,24.6 12.98,24.6 11.71,23.33 J1.P4
  Bottom 1.778: J1.P1 J1.P2 J1.P3 J1.P4
(copper drawn outside any net)
  shapes: Top circle x3

### Text on the board
tNames: LAMLOEI A092500 | 20220515 | LAMLOEI | A092500 | 1 | 40 | 2 | 39 | 3 | 38 | 4 | 37 | 5 | 36 | 6 | 35 | 7 | 34 | 8 | 33 | 9 | 32 | 10 | 31 | 11 | 30 | 12 | 29 | 13 | 28 | 14 | 27 | 15 | 26 | 16 | 25 | 17 | 24 | 18 | 23 | 19 | 22 | 20 | 21 | VU | LAMLOEI A092500 | 20220515
bNames: A092500 | LAMLOEI | 40 | 1 | 39 | 2 | 38 | 3 | 37 | 4 | 36 | 5 | 35 | 6 | 34 | 7 | 33 | 8 | 32 | 9 | 31 | 10 | 30 | 11 | 29 | 12 | 28 | 13 | 27 | 14 | 26 | 15 | 25 | 16 | 24 | 17 | 23 | 18 | 22 | 19 | 21 | 20 | VU
tDocu: X6 | X4 | X5 | U5 | U3 | U4 | U2 | U1 | J1 | X2 | J2 | X1 | J3 | J4 | X3